# Altium schematic sheet Main.SchDoc
size 381 x 241 mm; SheetNumber: 1; SheetTotal: 11
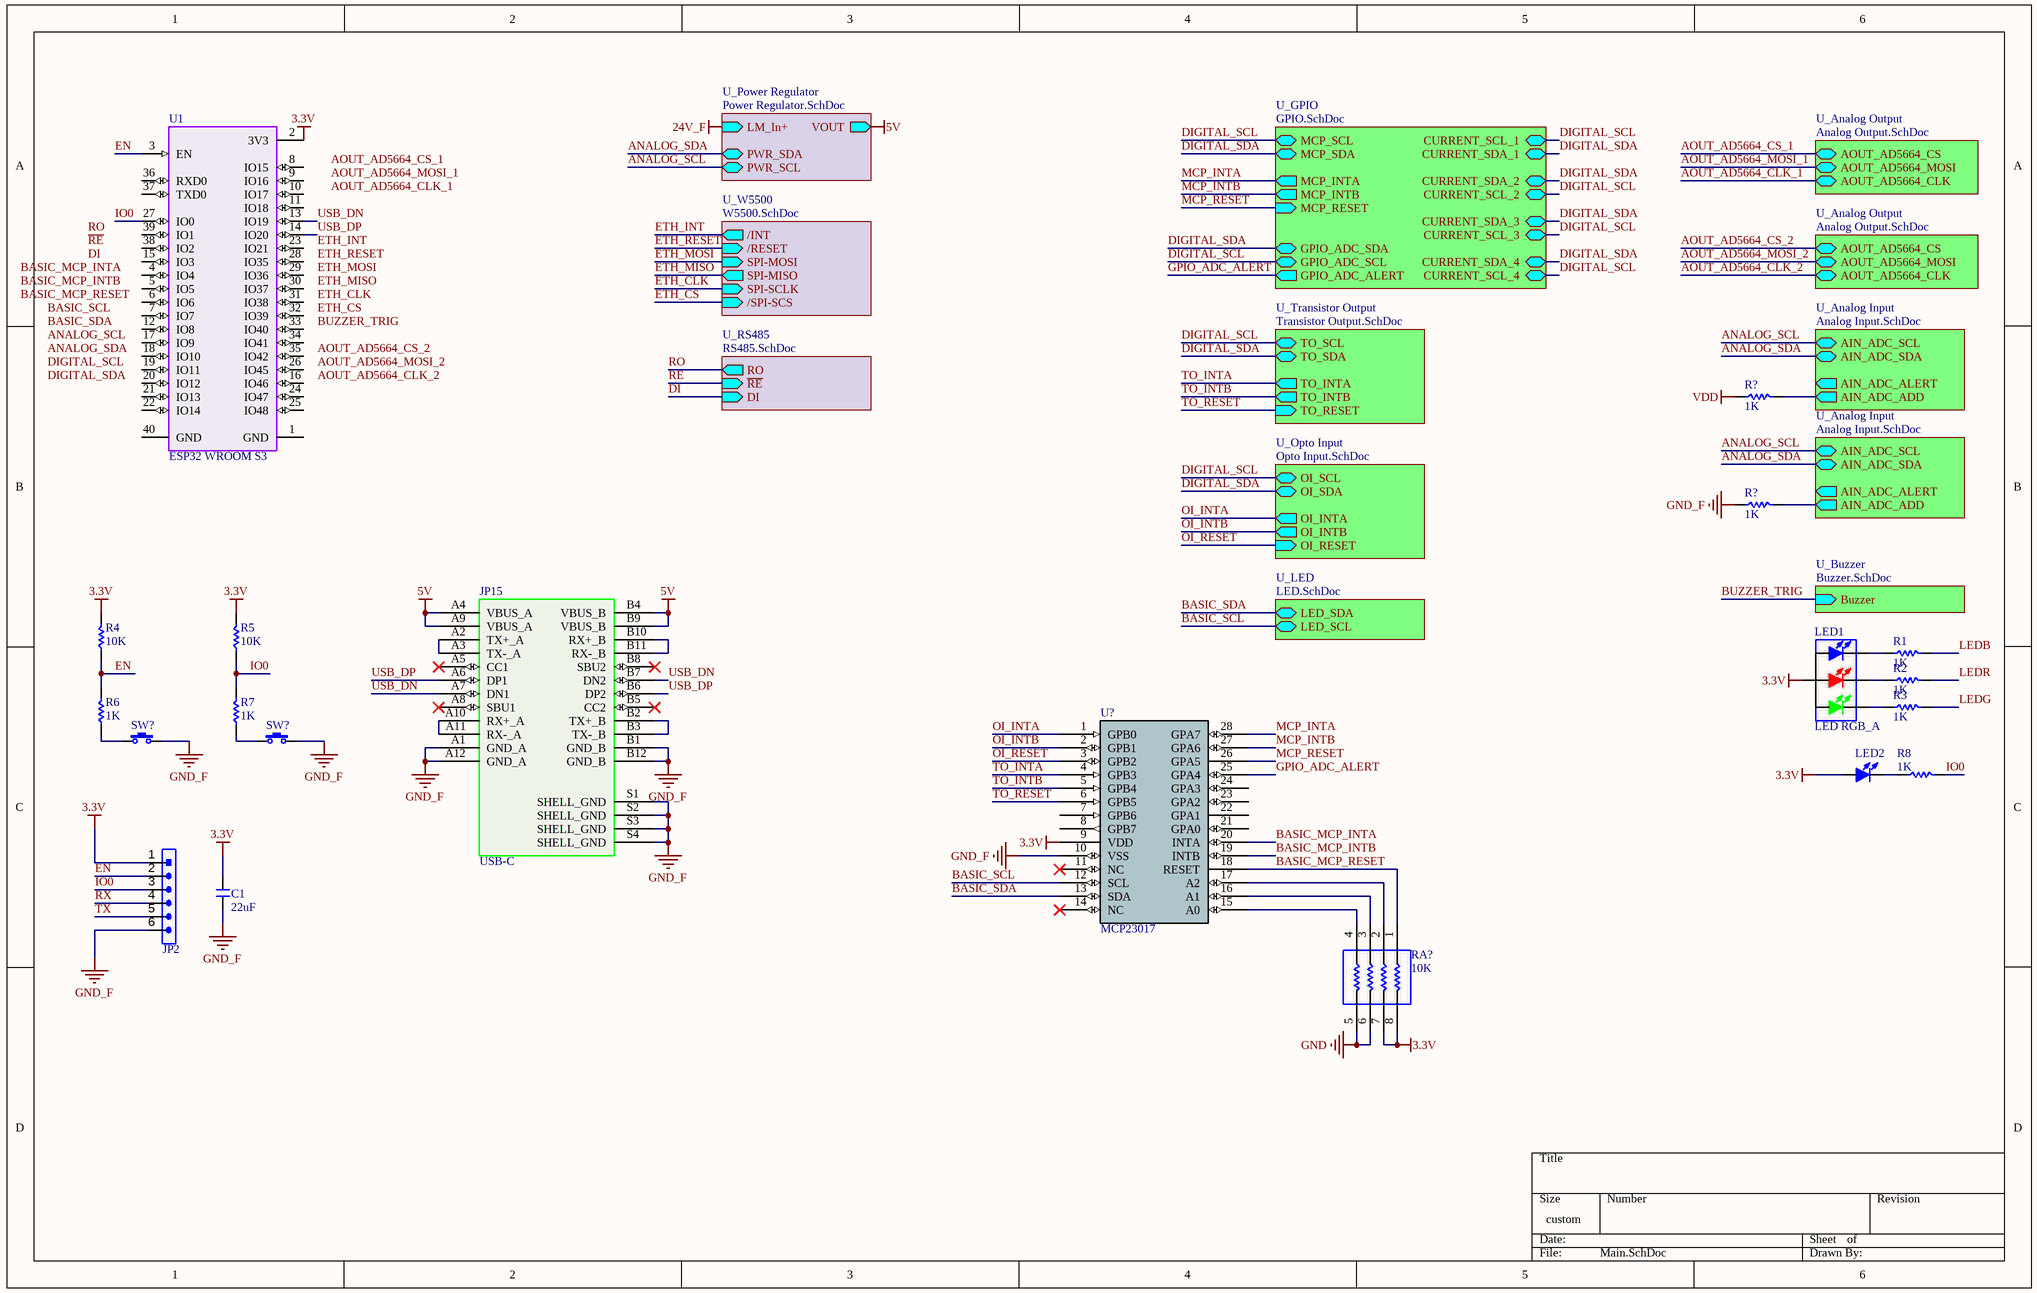
[diagram p0: Main.SchDoc]

## Parts
(Parts that share a designator on the sheet are numbered #1, #2 ... from top to bottom, then left to right.)
C1  22uF  [C 0805]
JP2  HDR-1X6  [HDR-1X6]  (value not drawn)
JP15  USB-C  [USB-C-RIGHT]
LED1  LED RGB_A  [RGB-0805-A]
LED2  LED-SMD  [LED 0805B]  (value not drawn)
R1  1K  [R 0805]
R2  1K  [R 0805]
R3  1K  [R 0805]
R4  10K  [R 0805]
R5  10K  [R 0805]
R6  1K  [R 0805]
R7  1K  [R 0805]
R8  1K  [R 0805]
R?#1  1K  [R 0805]
R?#2  1K  [R 0805]
RA?  10K  [RA1206 (4x0603)]
SW?#1  SKPMAPE010-6X6  [SKPMAPE010]  (value not drawn)
SW?#2  SKPMAPE010-6X6  [SKPMAPE010]  (value not drawn)
U1  ESP32 WROOM S3  [ESP32 WROOM S3]
U?  MCP23017  [SOIC28]

## Sub-sheets
U_Analog Input = Analog Input.SchDoc: AIN_ADC_SCL (bidir), AIN_ADC_SDA (bidir), AIN_ADC_ALERT (out), AIN_ADC_ADD (out)
U_Analog Input = Analog Input.SchDoc: AIN_ADC_SCL (bidir), AIN_ADC_SDA (bidir), AIN_ADC_ALERT (out), AIN_ADC_ADD (out)
U_Analog Output = Analog Output.SchDoc: AOUT_AD5664_CS (bidir), AOUT_AD5664_MOSI (bidir), AOUT_AD5664_CLK (bidir)
U_Analog Output = Analog Output.SchDoc: AOUT_AD5664_CS (bidir), AOUT_AD5664_MOSI (bidir), AOUT_AD5664_CLK (bidir)
U_Buzzer = Buzzer.SchDoc: Buzzer (in)
U_GPIO = GPIO.SchDoc: GPIO_ADC_ALERT (out), MCP_INTA (out), MCP_INTB (out), MCP_RESET (in), MCP_SCL (bidir), MCP_SDA (bidir), CURRENT_SCL_1 (bidir), CURRENT_SDA_1 (bidir), CURRENT_SDA_2 (bidir), CURRENT_SCL_2 (bidir), CURRENT_SDA_4 (bidir), CURRENT_SCL_4 (bidir), CURRENT_SDA_3 (bidir), CURRENT_SCL_3 (bidir), GPIO_ADC_SDA (bidir), GPIO_ADC_SCL (bidir)
U_LED = LED.SchDoc: LED_SDA (bidir), LED_SCL (bidir)
U_Opto Input = Opto Input.SchDoc: OI_SCL (bidir), OI_SDA (bidir), OI_INTA (out), OI_INTB (out), OI_RESET (in)
U_Power Regulator = Power Regulator.SchDoc: LM_In+ (in), VOUT (out), PWR_SCL (bidir), PWR_SDA (bidir)
U_RS485 = RS485.SchDoc: RO (out), ~{RE} (in), DI (in)
U_Transistor Output = Transistor Output.SchDoc: TO_SCL (bidir), TO_SDA (bidir), TO_INTA (out), TO_INTB (out), TO_RESET (in)
U_W5500 = W5500.SchDoc: /INT (out), /RESET (in), SPI-MOSI (in), SPI-MISO (out), SPI-SCLK (in), /SPI-SCS (in)

## Nets
3.3V: C1.1 JP2.1 LED1.3(RED_A) LED2.1(A) R4.2 R5.2 RA?.7 RA?.8 U1.2(3V3) U?.9(VDD)
5V: JP15.A4(VBUS_A) JP15.A9(VBUS_A) JP15.B4(VBUS_B) JP15.B9(VBUS_B) ; sheet U_Power Regulator/VOUT
24V_F: sheet U_Power Regulator/LM_In+
GND: RA?.5 RA?.6
GND_F: C1.2 JP2.6 JP15.A1(GND_A) JP15.A12(GND_A) JP15.B1(GND_B) JP15.B12(GND_B) JP15.S1(SHELL_GND) JP15.S2(SHELL_GND) JP15.S3(SHELL_GND) JP15.S4(SHELL_GND) R?#2.1 SW?#1.2 SW?#2.2 U?.10(VSS)
VDD: R?#1.1
ANALOG_SCL: sheet U_Power Regulator/PWR_SCL, sheet U_Analog Input/AIN_ADC_SCL, sheet U_Analog Input/AIN_ADC_SCL
ANALOG_SDA: sheet U_Power Regulator/PWR_SDA, sheet U_Analog Input/AIN_ADC_SDA, sheet U_Analog Input/AIN_ADC_SDA
AOUT_AD5664_CLK_1: sheet U_Analog Output/AOUT_AD5664_CLK
AOUT_AD5664_CLK_2: sheet U_Analog Output/AOUT_AD5664_CLK
AOUT_AD5664_CS_1: sheet U_Analog Output/AOUT_AD5664_CS
AOUT_AD5664_CS_2: sheet U_Analog Output/AOUT_AD5664_CS
AOUT_AD5664_MOSI_1: sheet U_Analog Output/AOUT_AD5664_MOSI
AOUT_AD5664_MOSI_2: sheet U_Analog Output/AOUT_AD5664_MOSI
BASIC_MCP_INTA: U?.20(INTA)
BASIC_MCP_INTB: U?.19(INTB)
BASIC_MCP_RESET: RA?.1 U?.18(RESET)
BASIC_SCL: U?.12(SCL) ; sheet U_LED/LED_SCL
BASIC_SDA: U?.13(SDA) ; sheet U_LED/LED_SDA
BUZZER_TRIG: sheet U_Buzzer/Buzzer
DI: sheet U_RS485/DI
DIGITAL_SCL: sheet U_Transistor Output/TO_SCL, sheet U_GPIO/MCP_SCL, sheet U_GPIO/CURRENT_SCL_1, sheet U_GPIO/CURRENT_SCL_2, sheet U_GPIO/CURRENT_SCL_4, sheet U_GPIO/CURRENT_SCL_3, sheet U_GPIO/GPIO_ADC_SCL, sheet U_Opto Input/OI_SCL
DIGITAL_SDA: sheet U_Transistor Output/TO_SDA, sheet U_GPIO/MCP_SDA, sheet U_GPIO/CURRENT_SDA_1, sheet U_GPIO/CURRENT_SDA_2, sheet U_GPIO/CURRENT_SDA_4, sheet U_GPIO/CURRENT_SDA_3, sheet U_GPIO/GPIO_ADC_SDA, sheet U_Opto Input/OI_SDA
EN: JP2.2 R4.1 R6.2 U1.3(EN)
ETH_CLK: sheet U_W5500/SPI-SCLK
ETH_CS: sheet U_W5500//SPI-SCS
ETH_INT: sheet U_W5500//INT
ETH_MISO: sheet U_W5500/SPI-MISO
ETH_MOSI: sheet U_W5500/SPI-MOSI
ETH_RESET: sheet U_W5500//RESET
GPIO_ADC_ALERT: U?.25(GPA4) ; sheet U_GPIO/GPIO_ADC_ALERT
IO0: JP2.3 R5.1 R7.2 R8.2 U1.27(IO0)
LEDB: R1.2
LEDG: R3.2
LEDR: R2.2
MCP_INTA: U?.28(GPA7) ; sheet U_GPIO/MCP_INTA
MCP_INTB: U?.27(GPA6) ; sheet U_GPIO/MCP_INTB
MCP_RESET: U?.26(GPA5) ; sheet U_GPIO/MCP_RESET
OI_INTA: U?.1(GPB0) ; sheet U_Opto Input/OI_INTA
OI_INTB: U?.2(GPB1) ; sheet U_Opto Input/OI_INTB
OI_RESET: U?.3(GPB2) ; sheet U_Opto Input/OI_RESET
~{RE}: sheet U_RS485/~{RE}
RO: sheet U_RS485/RO
RX: JP2.4
TO_INTA: U?.4(GPB3) ; sheet U_Transistor Output/TO_INTA
TO_INTB: U?.5(GPB4) ; sheet U_Transistor Output/TO_INTB
TO_RESET: U?.6(GPB5) ; sheet U_Transistor Output/TO_RESET
TX: JP2.5
USB_DN: JP15.A7(DN1) JP15.B7(DN2) U1.13(IO19)
USB_DP: JP15.A6(DP1) JP15.B6(DP2) U1.14(IO20)
NetJP15_A2: JP15.A2(TX+_A) JP15.A3(TX-_A)
NetJP15_A10: JP15.A10(RX+_A) JP15.A11(RX-_A)
NetJP15_B2: JP15.B2(TX+_B) JP15.B3(TX-_B)
NetJP15_B10: JP15.B10(RX+_B) JP15.B11(RX-_B)
NetLED1_1: LED1.1(BULE_K) R1.1
NetLED1_2: LED1.2(GREEN_K) R3.1
NetLED1_4: LED1.4(RED_K) R2.1
NetLED2_2: LED2.2(K) R8.1
NetR6_1: R6.1 SW?#1.1
NetR7_1: R7.1 SW?#2.1
NetR?#1_2: R?#1.2 ; sheet U_Analog Input/AIN_ADC_ADD
NetR?#2_2: R?#2.2 ; sheet U_Analog Input/AIN_ADC_ADD
NetRA?_2: RA?.2 U?.17(A2)
NetRA?_3: RA?.3 U?.16(A1)
NetRA?_4: RA?.4 U?.15(A0)

Not connected (* = marked no-connect by the designer): JP15 A5(CC1)* A8(SBU1)* B5(CC2)* B8(SBU2)*; U1 1(GND) 4(IO4) 5(IO5) 6(IO6) 7(IO7) 8(IO15) 9(IO16) 10(IO17) 11(IO18) 12(IO8) 15(IO3) 16(IO46) 17(IO9) 18(IO10) 19(IO11) 20(IO12) 21(IO13) 22(IO14) 23(IO21) 24(IO47) 25(IO48) 26(IO45) 28(IO35) 29(IO36) 30(IO37) 31(IO38) 32(IO39) 33(IO40) 34(IO41) 35(IO42) 36(RXD0) 37(TXD0) 38(IO2) 39(IO1) 40(GND); U? 7(GPB6) 8(GPB7) 11(NC)* 14(NC)* 21(GPA0) 22(GPA1) 23(GPA2) 24(GPA3)

## Notes on the sheet
- Labels drawn without touching a wire or pin: ANALOG_SCL, ANALOG_SDA, AOUT_AD5664_CLK_1, AOUT_AD5664_CLK_2, AOUT_AD5664_CS_1, AOUT_AD5664_CS_2, AOUT_AD5664_MOSI_1, AOUT_AD5664_MOSI_2, BASIC_MCP_INTA, BASIC_MCP_INTB, BASIC_MCP_RESET, BASIC_SCL, BASIC_SDA, BUZZER_TRIG, DI, DIGITAL_SCL, DIGITAL_SDA, ETH_CLK, ETH_CS, ETH_INT, ETH_MISO, ETH_MOSI, ETH_RESET, RO, ~{RE}

## Library data of the parts
C1 = C: Non-polar patch capacitor; BOM名称: 无极性贴片电容; 版权归属: 源创客; 学习资源: www.ooocke.com
JP2 = Header 6: 6P Connector; BOM名称: 6P接插件; 版权归属: 源创客; 学习资源: www.ooocke.com
JP15 = USB-C-RIGHT
LED2 = LED-SMD: Patch LED; BOM名称: 贴片LED; 版权归属: 源创客; 学习资源: www.ooocke.com
R1-R8 R?#1 R?#2 = R: Chip resistor; 版权归属: 源创客; BOM名称: Chip resistor; 学习资源: www.ooocke.com
RA? = R-ARR: 4 way Chip Resistor Array
SW?#1 SW?#2 = SKPMAPE010-6X6: Carbon Tactile